# Altium project xBreak.PrjPcb
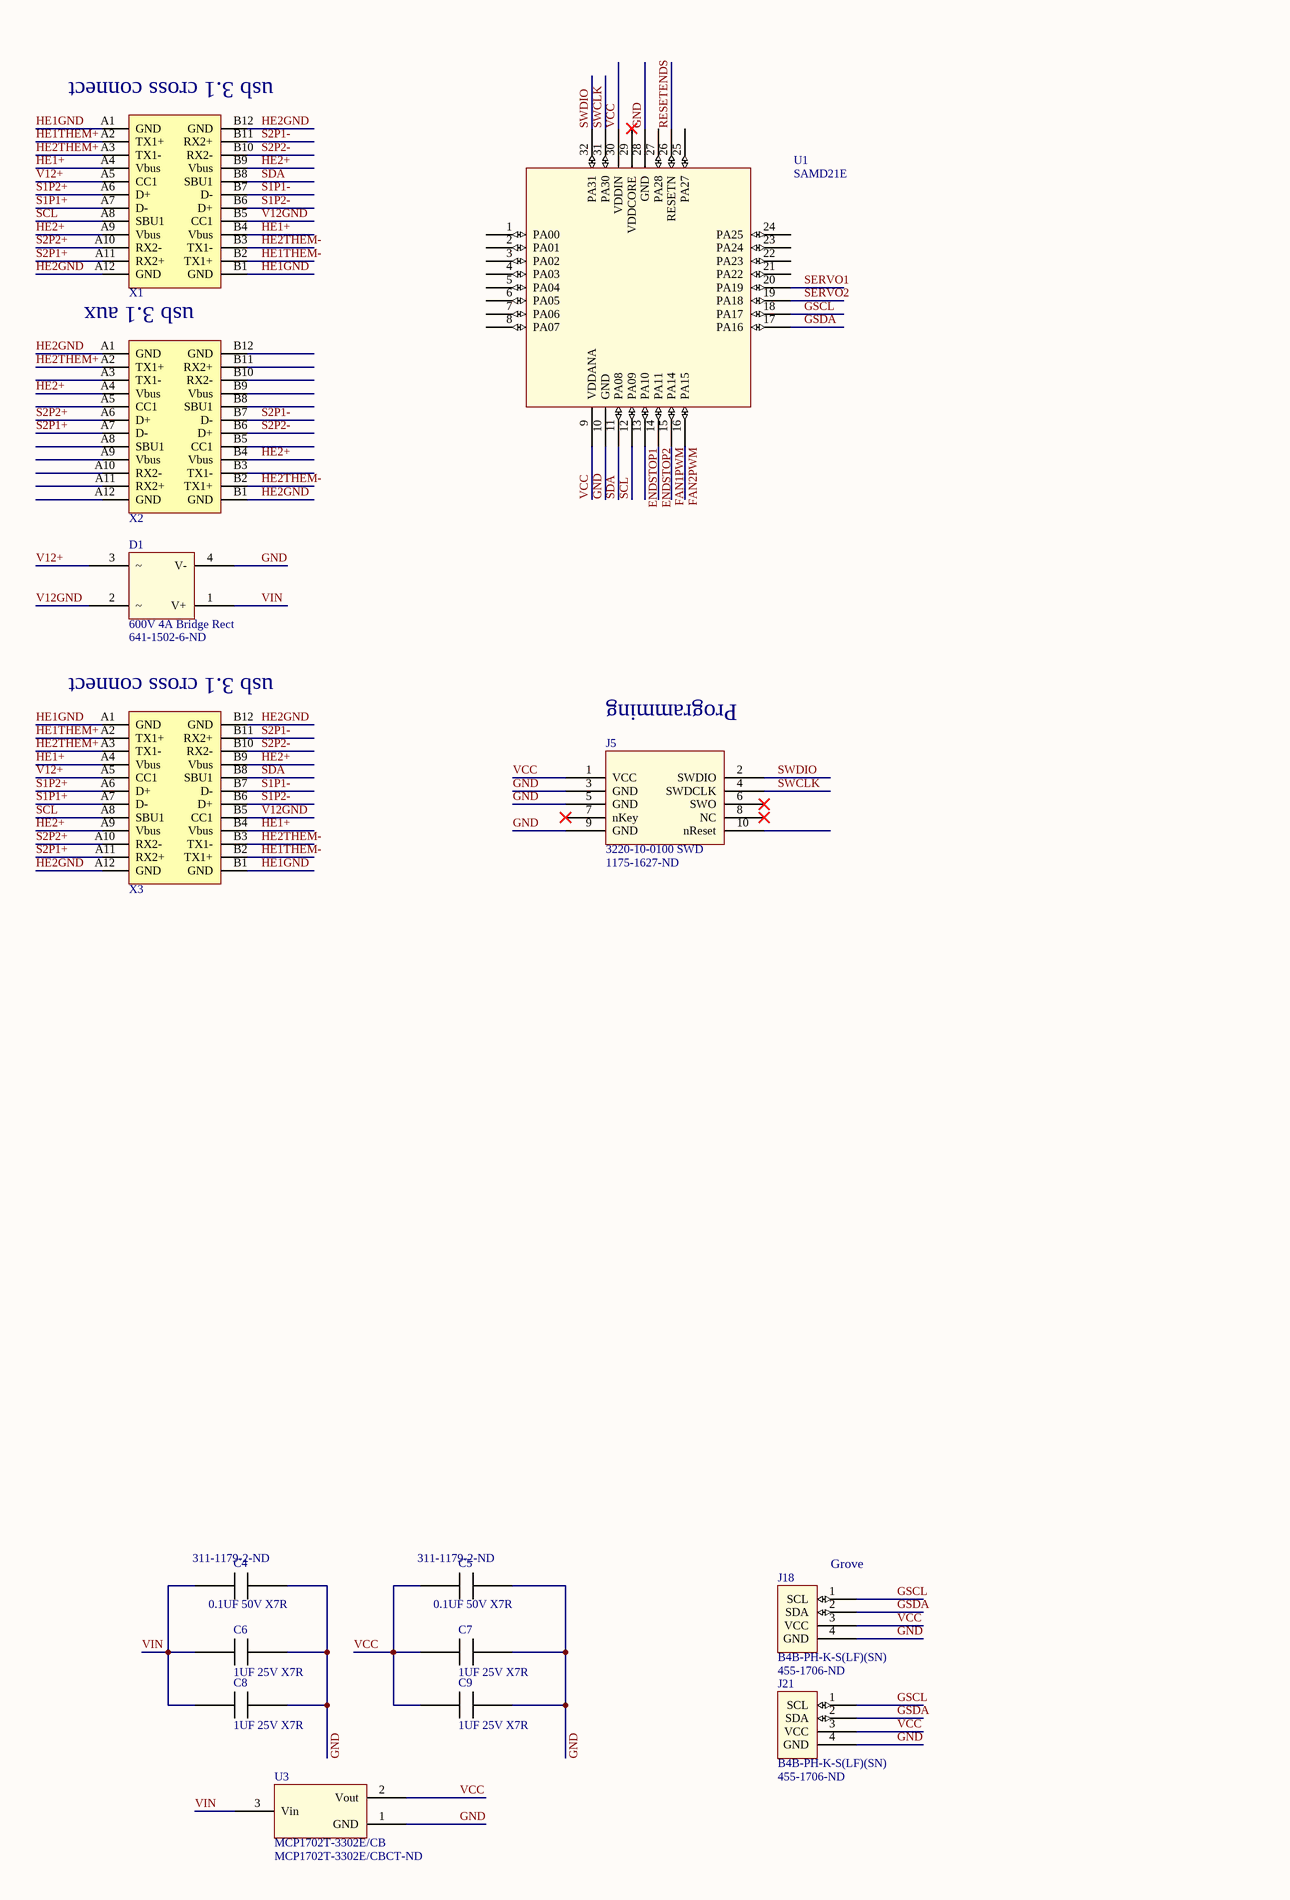
[diagram p0: Sheet1_xbreak.SchDoc, left]
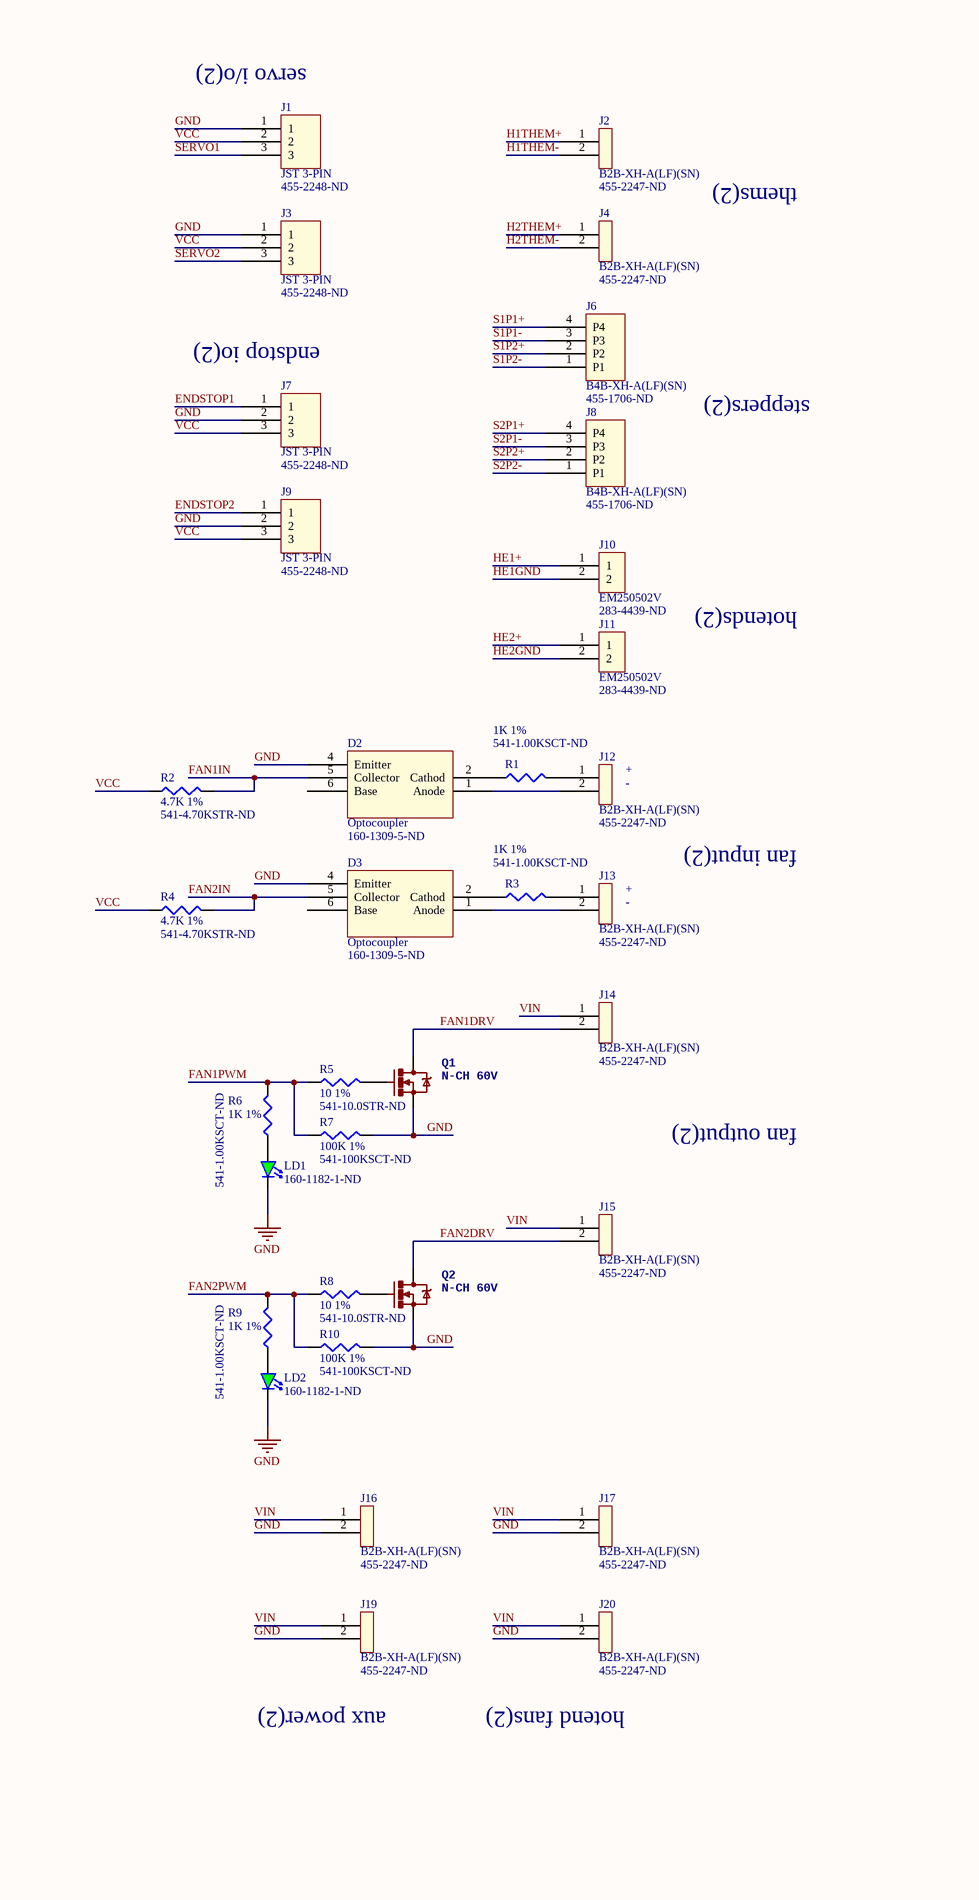
[diagram p1: Sheet1_xbreak.SchDoc, right]
1 sheet, 49 parts. Net scope: global (net labels, ports and power ports of the same name join across sheets).

## Sheet Sheet1_xbreak.SchDoc: xBreak Breakout Board
size C; Date: Jan 3, 2015; CompanyName: Neural Cloud Computing Pte Ltd; DrawnBy: Glenn West; Engineer: Glenn West; DocumentNumber: 1210-1; DocumentName: xBreak1; ProjectName: Xbreak1

### Parts
C4  0.1UF 50V X7R  Supplier Part Number 1: 311-1179-2-ND  [C1206YageoX7R]
C5  0.1UF 50V X7R  Supplier Part Number 1: 311-1179-2-ND  [C1206YageoX7R]
C6  1UF 25V X7R  [C1206YageoX7R]
C7  1UF 25V X7R  [C1206YageoX7R]
C8  1UF 25V X7R  [C1206YageoX7R]
C9  1UF 25V X7R  [C1206YageoX7R]
D1  600V 4A Bridge Rect  Supplier Part Number 1: 641-1502-6-ND  [Z4DGP406L-HF]
D2  Optocoupler  Supplier Part Number 1: 160-1309-5-ND  [CNY17-1S]
D3  Optocoupler  Supplier Part Number 1: 160-1309-5-ND  [CNY17-1S]
J1  JST 3-PIN  Supplier Part Number 1: 455-2248-ND  [B3B-XH-A(LF)(SN)]
J2  B2B-XH-A(LF)(SN)  Supplier Part Number 1: 455-2247-ND  [77311-118-02LF]
J3  JST 3-PIN  Supplier Part Number 1: 455-2248-ND  [B3B-XH-A(LF)(SN)]
J4  B2B-XH-A(LF)(SN)  Supplier Part Number 1: 455-2247-ND  [77311-118-02LF]
J5  3220-10-0100 SWD  Supplier Part Number 1: 1175-1627-ND  [3220-10-0100]
J6  B4B-XH-A(LF)(SN)  Supplier Part Number 1: 455-1706-ND  [B4B-PH-K-S(LF)(SN)]
J7  JST 3-PIN  Supplier Part Number 1: 455-2248-ND  [B3B-XH-A(LF)(SN)]
J8  B4B-XH-A(LF)(SN)  Supplier Part Number 1: 455-1706-ND  [B4B-PH-K-S(LF)(SN)]
J9  JST 3-PIN  Supplier Part Number 1: 455-2248-ND  [B3B-XH-A(LF)(SN)]
J10  EM250502V  Supplier Part Number 1: 283-4439-ND  [EM250502V]
J11  EM250502V  Supplier Part Number 1: 283-4439-ND  [EM250502V]
J12  B2B-XH-A(LF)(SN)  Supplier Part Number 1: 455-2247-ND  [77311-118-02LF]
J13  B2B-XH-A(LF)(SN)  Supplier Part Number 1: 455-2247-ND  [77311-118-02LF]
J14  B2B-XH-A(LF)(SN)  Supplier Part Number 1: 455-2247-ND  [77311-118-02LF]
J15  B2B-XH-A(LF)(SN)  Supplier Part Number 1: 455-2247-ND  [77311-118-02LF]
J16  B2B-XH-A(LF)(SN)  Supplier Part Number 1: 455-2247-ND  [77311-118-02LF]
J17  B2B-XH-A(LF)(SN)  Supplier Part Number 1: 455-2247-ND  [77311-118-02LF]
J18  B4B-PH-K-S(LF)(SN)  Supplier Part Number 1: 455-1706-ND  [B4B-PH-K-S(LF)(SN)]
J19  B2B-XH-A(LF)(SN)  Supplier Part Number 1: 455-2247-ND  [77311-118-02LF]
J20  B2B-XH-A(LF)(SN)  Supplier Part Number 1: 455-2247-ND  [77311-118-02LF]
J21  B4B-PH-K-S(LF)(SN)  Supplier Part Number 1: 455-1706-ND  [B4B-PH-K-S(LF)(SN)]
LD1  Supplier Part Number 1: 160-1182-1-ND  [LED0603]  (hidden comment: RED)
LD2  Supplier Part Number 1: 160-1182-1-ND  [LED0603]  (hidden comment: RED)
Q1  N-CH 60V  [SOT669]
Q2  N-CH 60V  [SOT669]
R1  1K 1%  Supplier Part Number 1: 541-1.00KSCT-ND  [12Z-2010]
R2  4.7K 1%  Supplier Part Number 1: 541-4.70KSTR-ND  [J1-0603]
R3  1K 1%  Supplier Part Number 1: 541-1.00KSCT-ND  [12Z-2010]
R4  4.7K 1%  Supplier Part Number 1: 541-4.70KSTR-ND  [J1-0603]
R5  10 1%  Supplier Part Number 1: 541-10.0STR-ND  [J1-0603]
R6  1K 1%  Supplier Part Number 1: 541-1.00KSCT-ND  [12Z-2010]
R7  100K 1%  Supplier Part Number 1: 541-100KSCT-ND  [J1-0603]
R8  10 1%  Supplier Part Number 1: 541-10.0STR-ND  [J1-0603]
R9  1K 1%  Supplier Part Number 1: 541-1.00KSCT-ND  [12Z-2010]
R10  100K 1%  Supplier Part Number 1: 541-100KSCT-ND  [J1-0603]
U1  SAMD21E  [ATSAMD21E15L-MFT]
U3  MCP1702T-3302E/CB  Supplier Part Number 1: MCP1702T-3302E/CBCT-ND  [MCP1702-SOT-23A]
X1  USB_3_1  [USB_3.1]  (value not drawn)
X2  USB_3_1  [USB_3.1]  (value not drawn)
X3  USB_3_1  [USB_3.1]  (value not drawn)

### Nets
GND: C4.2 C5.2 C6.2 C7.2 C8.2 C9.2 D1.4(V-) D2.4(Emitter) D3.4(Emitter) J1.1 J3.1 J5.3(GND) J5.5(GND) J5.9(GND) J7.2 J9.2 J16.2 J17.2 J18.4(GND) J19.2 J20.2 J21.4(GND) LD1.2(K) LD2.2(K) Q1.S Q2.S R7.2 R10.2 U1.10(GND) U1.28(GND) U1.33(TGND) U3.1(GND)
ENDSTOP1: J7.1 U1.13(PA10)
ENDSTOP2: J9.1 U1.14(PA11)
FAN1DRV: J14.2 Q1.D
FAN1IN: D2.5(Collector) R2.2
FAN1PWM: R5.1 R6.2 R7.1 U1.15(PA14)
FAN2DRV: J15.2 Q2.D
FAN2IN: D3.5(Collector) R4.2
FAN2PWM: R8.1 R9.2 R10.1 U1.16(PA15)
GSCL: J18.1(SCL) J21.1(SCL) U1.18(PA17)
GSDA: J18.2(SDA) J21.2(SDA) U1.17(PA16)
H1THEM+: J2.1
H1THEM-: J2.2
H2THEM+: J4.1
H2THEM-: J4.2
HE1+: J10.1 X1.A4(Vbus) X1.B4(Vbus) X3.A4(Vbus) X3.B4(Vbus)
HE1GND: J10.2 X1.A1(GND) X1.B1(GND) X3.A1(GND) X3.B1(GND)
HE1THEM+: X1.A2(TX1+) X3.A2(TX1+)
HE1THEM-: X1.B2(TX1+) X3.B2(TX1+)
HE2+: J11.1 X1.A9(Vbus) X1.B9(Vbus) X2.A4(Vbus) X2.B4(Vbus) X3.A9(Vbus) X3.B9(Vbus)
HE2GND: J11.2 X1.A12(GND) X1.B12(GND) X2.A1(GND) X2.B1(GND) X3.A12(GND) X3.B12(GND)
HE2THEM+: X1.A3(TX1-) X2.A2(TX1+) X3.A3(TX1-)
HE2THEM-: X1.B3(TX1-) X2.B2(TX1+) X3.B3(TX1-)
RESETENDS: U1.26(RESETN)
S1P1+: J6.4(P4) X1.A7(D-) X3.A7(D-)
S1P1-: J6.3(P3) X1.B7(D-) X3.B7(D-)
S1P2+: J6.2(P2) X1.A6(D+) X3.A6(D+)
S1P2-: J6.1(P1) X1.B6(D+) X3.B6(D+)
S2P1+: J8.4(P4) X1.A11(RX2+) X2.A7(D-) X3.A11(RX2+)
S2P1-: J8.3(P3) X1.B11(RX2+) X2.B7(D-) X3.B11(RX2+)
S2P2+: J8.2(P2) X1.A10(RX2-) X2.A6(D+) X3.A10(RX2-)
S2P2-: J8.1(P1) X1.B10(RX2-) X2.B6(D+) X3.B10(RX2-)
SCL: U1.12(PA09) X1.A8(SBU1) X3.A8(SBU1)
SDA: U1.11(PA08) X1.B8(SBU1) X3.B8(SBU1)
SERVO1: J1.3 U1.20(PA19)
SERVO2: J3.3 U1.19(PA18)
SWCLK: J5.4(SWDCLK) U1.31(PA30)
SWDIO: J5.2(SWDIO) U1.32(PA31)
V12+: D1.3 X1.A5(CC1) X3.A5(CC1)
V12GND: D1.2 X1.B5(CC1) X3.B5(CC1)
VCC: C5.1 C7.1 C9.1 J1.2 J3.2 J5.1(VCC) J7.3 J9.3 J18.3(VCC) J21.3(VCC) R2.1 R4.1 U1.9(VDDANA) U1.30(VDDIN) U3.2(Vout)
VIN: C4.1 C6.1 C8.1 D1.1(V+) J14.1 J15.1 J16.1 J17.1 J19.1 J20.1 U3.3(Vin)
NetD2_1: D2.1(Anode) J12.2
NetD2_2: D2.2(Cathod) R1.1
NetD3_1: D3.1(Anode) J13.2
NetD3_2: D3.2(Cathod) R3.1
NetJ12_1: J12.1 R1.2
NetJ13_1: J13.1 R3.2
NetLD1_1: LD1.1(A) R6.1
NetLD2_1: LD2.1(A) R9.1
NetQ1_G: Q1.G R5.2
NetQ2_G: Q2.G R8.2

Not connected (* = marked no-connect by the designer): D2 3(NC) 6(Base); D3 3(NC) 6(Base); J5 6(SWO)* 7(nKey)* 8(NC)* 10(nReset); U1 1(PA00) 2(PA01) 3(PA02) 4(PA03) 5(PA04) 6(PA05) 7(PA06) 8(PA07) 21(PA22) 22(PA23) 23(PA24) 24(PA25) 25(PA27) 27(PA28) 29(VDDCORE)*; X2 A3(TX1-) A5(CC1) A8(SBU1) A9(Vbus) A10(RX2-) A11(RX2+) A12(GND) B3(TX1-) B5(CC1) B8(SBU1) B9(Vbus) B10(RX2-) B11(RX2+) B12(GND)

### Notes on the sheet
- (near X1) usb 3.1 cross connect
- (near J1) servo i/o(2)
- thems(2)
- usb 3.1 aux
- (near J7) endstop io(2)
- steppers(2)
- hotends(2)
- (near X3) usb 3.1 cross connect
- Programming
- (near J12) +
- (near J12) -
- (near J13) +
- fan input(2)
- (near J13) -
- fan output(2)
- (near J18) Grove
- aux power(2)
- hotend fans(2)

### Library data of the parts
C4 C5 = CC1206KRX7R9BB104: CAP CER 0.1UF 50V X7R 1206 YAGEO CC1206KRX7R9BB104; Supplier 1: Digi-Key
C6-C9 = CC1206KKX7R8BB105: CAP CER 1UF 25V X7R 1206 Yageo CC1206KKX7R8BB105; Supplier 1: Digi-Key; Supplier Part Number 1: 311-1356-2-ND
D1 = Z4DGP406L-HF: RECT BRIDGE GP 600V 4A Z4-D ComChip Z4DGP406L-HF; Supplier 1: Digi-Key
D2 D3 = CNY17-1S: OPTOISO 5KV TRANS W/BASE 6SMD  Lite-On CNY17-1S; Supplier 1: Digi-Key
J1 J3 J7 J9 = B3B-XH-A(LF)(SN): CONN HEADER XH TOP 3POS 2.5MM JST B3B-XH-A(LF)(SN); Supplier 1: Digi-Key
J2 J4 J12-J17 J19 J20 = B2B-XH-A(LF)(SN): CONN HEADER XH TOP 2POS 2.5MM  JST B2B-XH-A(LF)(SN); Supplier 1: Digi-Key
J5 = 3220-10-0100-00: HiRose 3220-10-0100 BOX HEADER, 0.050 10 POS; Supplier 1: Digi-Key
J6 J8 = B4B-XH-A(LF)(SN): CONN HEADER XH TOP 4POS 2.5MM JST B4B-XH-A(LF)(SN); Supplier 1: Digi-Key
J10 J11 = EM250502V: TERM BLOCK 16A 300V 12-26AWG Eaton Bussman EM250502V; Supplier 1: Digi-Key
LD1 LD2 = LTST-C190EKT: LED RED CLEAR 0603 SMD LITE-ON LTST-C190EKT; Supplier 1: Digi-Key
Q1 Q2 = PSMN7R0-60YS,115: MOSFET N-CH 60V LFPAK NXP PSMN7R0-60YS,115; PROD_ID: IC-08089; Supplier 1: Digi-Key; Supplier Part Number 1: 568-5596-1-ND
R1 R3 R6 R9 = CRCW06031K00FKEAHP: Resistor 1K 1% 0603 CRCW06031K00FKEAHP; Published: 8-Jun-2000; LatestRevisionDate: 29-May-2009; LatestRevisionNote: IPC-7351 Footprint Added.; PackageReference: J1-0603; Publisher: Altium Limited; PackageDescription: Chip Resistor; Value: 1K; Supplier 1: Digi-Key
R2 R4 = CRCW06034K70FKEAHP: Resistor 4.7K 1% 0603 Vishay CRCW06034K70FKEAHP; Value: 1K; Published: 8-Jun-2000; LatestRevisionDate: 29-May-2009; LatestRevisionNote: IPC-7351 Footprint Added.; PackageReference: J1-0603; Publisher: Altium Limited; PackageDescription: Chip Resistor; Supplier 1: Digi-Key
R5 R8 = CRCW060310R0FKEAHP: Resistor 10 1% 0603 Vishay CRCW060310R0FKEAHP; Value: 10; Published: 8-Jun-2000; LatestRevisionDate: 29-May-2009; LatestRevisionNote: IPC-7351 Footprint Added.; PackageReference: J1-0603; Publisher: Altium Limited; PackageDescription: Chip Resistor; Supplier 1: Digi-Key
R7 R10 = CRCW0603100KFKEAHP: Resistor 100K 1% 0603 Vishay CRCW0603100KFKEAHP; Published: 8-Jun-2000; LatestRevisionDate: 29-May-2009; LatestRevisionNote: IPC-7351 Footprint Added.; PackageReference: J1-0603; Publisher: Altium Limited; PackageDescription: Chip Resistor; Value: 100K; Supplier 1: Digi-Key
U1 = ATSAMD21E15L-MFT: IC MCU 32BIT 32KB FLASH 32QFN Atmel ATSAMD21E15L-MFT
U3 = MCP1702: IC REG LDO 3.3V 0.25A SOT23A-3 Microchip MCP1702T-3302E/CB; Supplier 1: Digi-Key
X1-X3 = USB 3.1: USB 3.1 Connector; Manufacturer: Amphenol Commercial Products; Manufacturer Part Number: 12401548E4#2A; Connector Type: USB - C; Number of Contacts: 24; Gender: Receptacle; Specifications: USB 3.1, Superspeed+; Supplier 1: Digi-Key; Supplier Part Number 1: 12401548E4#2ACT-ND; RoHS: RoHS Compliant; Category: Connectors, Interconnects; Stock 1: 5275; Pricing 1: 1=1.87, 10=1.698, 25=1.594, 50=1.5246, 100=1.4553, 250=1.31672 (USD); Packaging: Cut Tape (CT); Mounting Type: Surface Mount, Right Angle; Through Hole; Features: Board Guide; Ingress Protection: -; ComponentLink1URL: https://www.amphenolcanada.com/ProductSearch/drawings/AC/12401548E4#2A.pdf; ComponentLink1Description: https://www.amphenolcanada.com/ProductSearch/drawings/AC/12401548E4#2A.pdf
J18 J21 = B4B-PH-K-S(LF)(SN): Supplier 1: Digi-Key